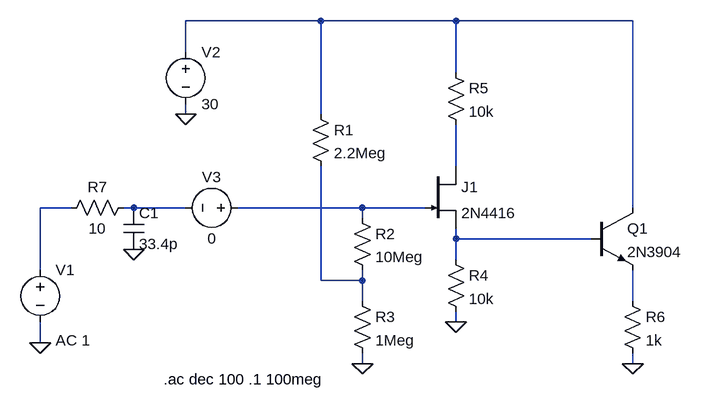
[diagram p0: schematic amplificador segunda opcion.asc]
amplificador segunda opcion.asc, the LTspice schematic file:
Version 4
SHEET 1 880 680
WIRE 16 -32 -192 -32
WIRE 224 -32 16 -32
WIRE 496 -32 224 -32
WIRE -192 16 -192 -32
WIRE 224 48 224 -32
WIRE -192 112 -192 96
WIRE 16 112 16 -32
WIRE 224 192 224 128
WIRE -368 256 -416 256
WIRE -272 256 -288 256
WIRE -192 256 -272 256
WIRE 80 256 -112 256
WIRE 176 256 80 256
WIRE 496 256 496 -32
WIRE 80 272 80 256
WIRE 224 304 224 288
WIRE 432 304 224 304
WIRE 224 336 224 304
WIRE -416 352 -416 256
WIRE 16 368 16 192
WIRE 80 368 80 352
WIRE 80 368 16 368
WIRE 80 400 80 368
WIRE 496 400 496 352
WIRE 224 432 224 416
WIRE -416 464 -416 432
WIRE 80 496 80 480
WIRE 496 496 496 480
FLAG -416 464 0
FLAG 80 496 0
FLAG 224 432 0
FLAG 496 496 0
FLAG -192 112 0
FLAG -272 320 0
SYMBOL njf 176 192 R0
SYMATTR InstName J1
SYMATTR Value 2N4416
SYMBOL res 0 96 R0
SYMATTR InstName R1
SYMATTR Value 2.2Meg
SYMBOL res 64 256 R0
SYMATTR InstName R2
SYMATTR Value 10Meg
SYMBOL res 64 384 R0
SYMATTR InstName R3
SYMATTR Value 1Meg
SYMBOL res 208 320 R0
SYMATTR InstName R4
SYMATTR Value 10k
SYMBOL res 208 32 R0
SYMATTR InstName R5
SYMATTR Value 10k
SYMBOL npn 432 256 R0
SYMATTR InstName Q1
SYMATTR Value 2N3904
SYMBOL res 480 384 R0
SYMATTR InstName R6
SYMATTR Value 1k
SYMBOL voltage -416 336 R0
WINDOW 123 24 124 Left 2
WINDOW 39 0 0 Left 0
SYMATTR InstName V1
SYMATTR Value ""
SYMATTR Value2 AC 1
SYMBOL voltage -192 0 R0
WINDOW 123 0 0 Left 0
WINDOW 39 0 0 Left 0
SYMATTR InstName V2
SYMATTR Value 30
SYMBOL res -272 240 R90
WINDOW 0 0 56 VBottom 2
WINDOW 3 32 56 VTop 2
SYMATTR InstName R7
SYMATTR Value 10
SYMBOL cap -288 256 R0
SYMATTR InstName C1
SYMATTR Value 33.4p
SYMBOL voltage -96 256 R90
WINDOW 0 -32 56 VBottom 2
WINDOW 3 32 56 VTop 2
WINDOW 123 0 0 Left 0
WINDOW 39 0 0 Left 0
SYMATTR InstName V3
SYMATTR Value 0
TEXT -226 520 Left 2 !.ac dec 100 .1 100meg

The netlist it stands for:
* amplificador segunda opcion.asc
J1 N002 N005 N006 2N4416
R1 N001 N007 2.2Meg
R2 N005 N007 10Meg
R3 N007 0 1Meg
R4 N006 0 10k
R5 N001 N002 10k
Q1 N001 N006 N008 0 2N3904
R6 N008 0 1k
V1 N003 0 AC 1
V2 N001 0 30
R7 N004 N003 10
C1 N004 0 33.4p
V3 N005 N004 0
.model NPN NPN
.model PNP PNP
.lib standard.bjt
.model NJF NJF
.model PJF PJF
.lib standard.jft
.ac dec 100 .1 100meg
.backanno
.end